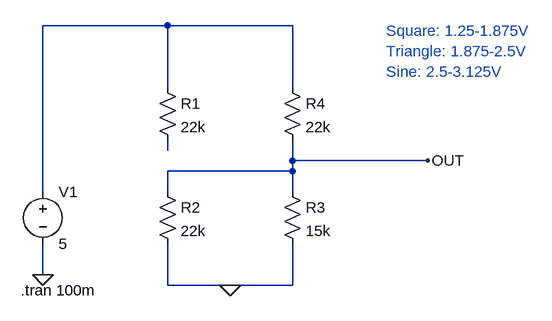
[diagram p0: schematic ShapeDivider.asc]
ShapeDivider.asc, the LTspice schematic file:
Version 4
SHEET 1 916 680
WIRE 352 -144 160 -144
WIRE 544 -144 352 -144
WIRE 352 -48 352 -144
WIRE 544 -48 544 -144
WIRE 352 48 352 32
WIRE 544 64 544 32
WIRE 752 64 544 64
WIRE 544 80 544 64
WIRE 544 80 352 80
WIRE 160 112 160 -144
WIRE 352 112 352 80
WIRE 544 112 544 80
WIRE 160 240 160 192
WIRE 352 256 352 192
WIRE 448 256 352 256
WIRE 544 256 544 192
WIRE 544 256 448 256
FLAG 160 240 0
FLAG 752 64 OUT
FLAG 448 256 0
SYMBOL voltage 160 96 R0
WINDOW 123 0 0 Left 2
WINDOW 39 0 0 Left 2
SYMATTR InstName V1
SYMATTR Value 5
SYMBOL res 336 -64 R0
SYMATTR InstName R1
SYMATTR Value 22k
SYMBOL res 336 96 R0
SYMATTR InstName R2
SYMATTR Value 22k
SYMBOL res 528 96 R0
SYMATTR InstName R3
SYMATTR Value 15k
SYMBOL res 528 -64 R0
SYMATTR InstName R4
SYMATTR Value 22k
TEXT 688 -136 Left 2 ;Square: 1.25-1.875V\nTriangle: 1.875-2.5V\nSine: 2.5-3.125V
TEXT 126 264 Left 2 !.tran 100m

The netlist it stands for:
* ShapeDivider.asc
V1 N001 0 5
R1 N001 N002 22k
R2 OUT 0 22k
R3 OUT 0 15k
R4 N001 OUT 22k
* Square: 1.25-1.875V
* Triangle: 1.875-2.5V
* Sine: 2.5-3.125V
.tran 100m
.backanno
.end